# EAGLE design SparkFun_Transceiver_Breakout_NRF24LU1 (EAGLE 7.2.0)
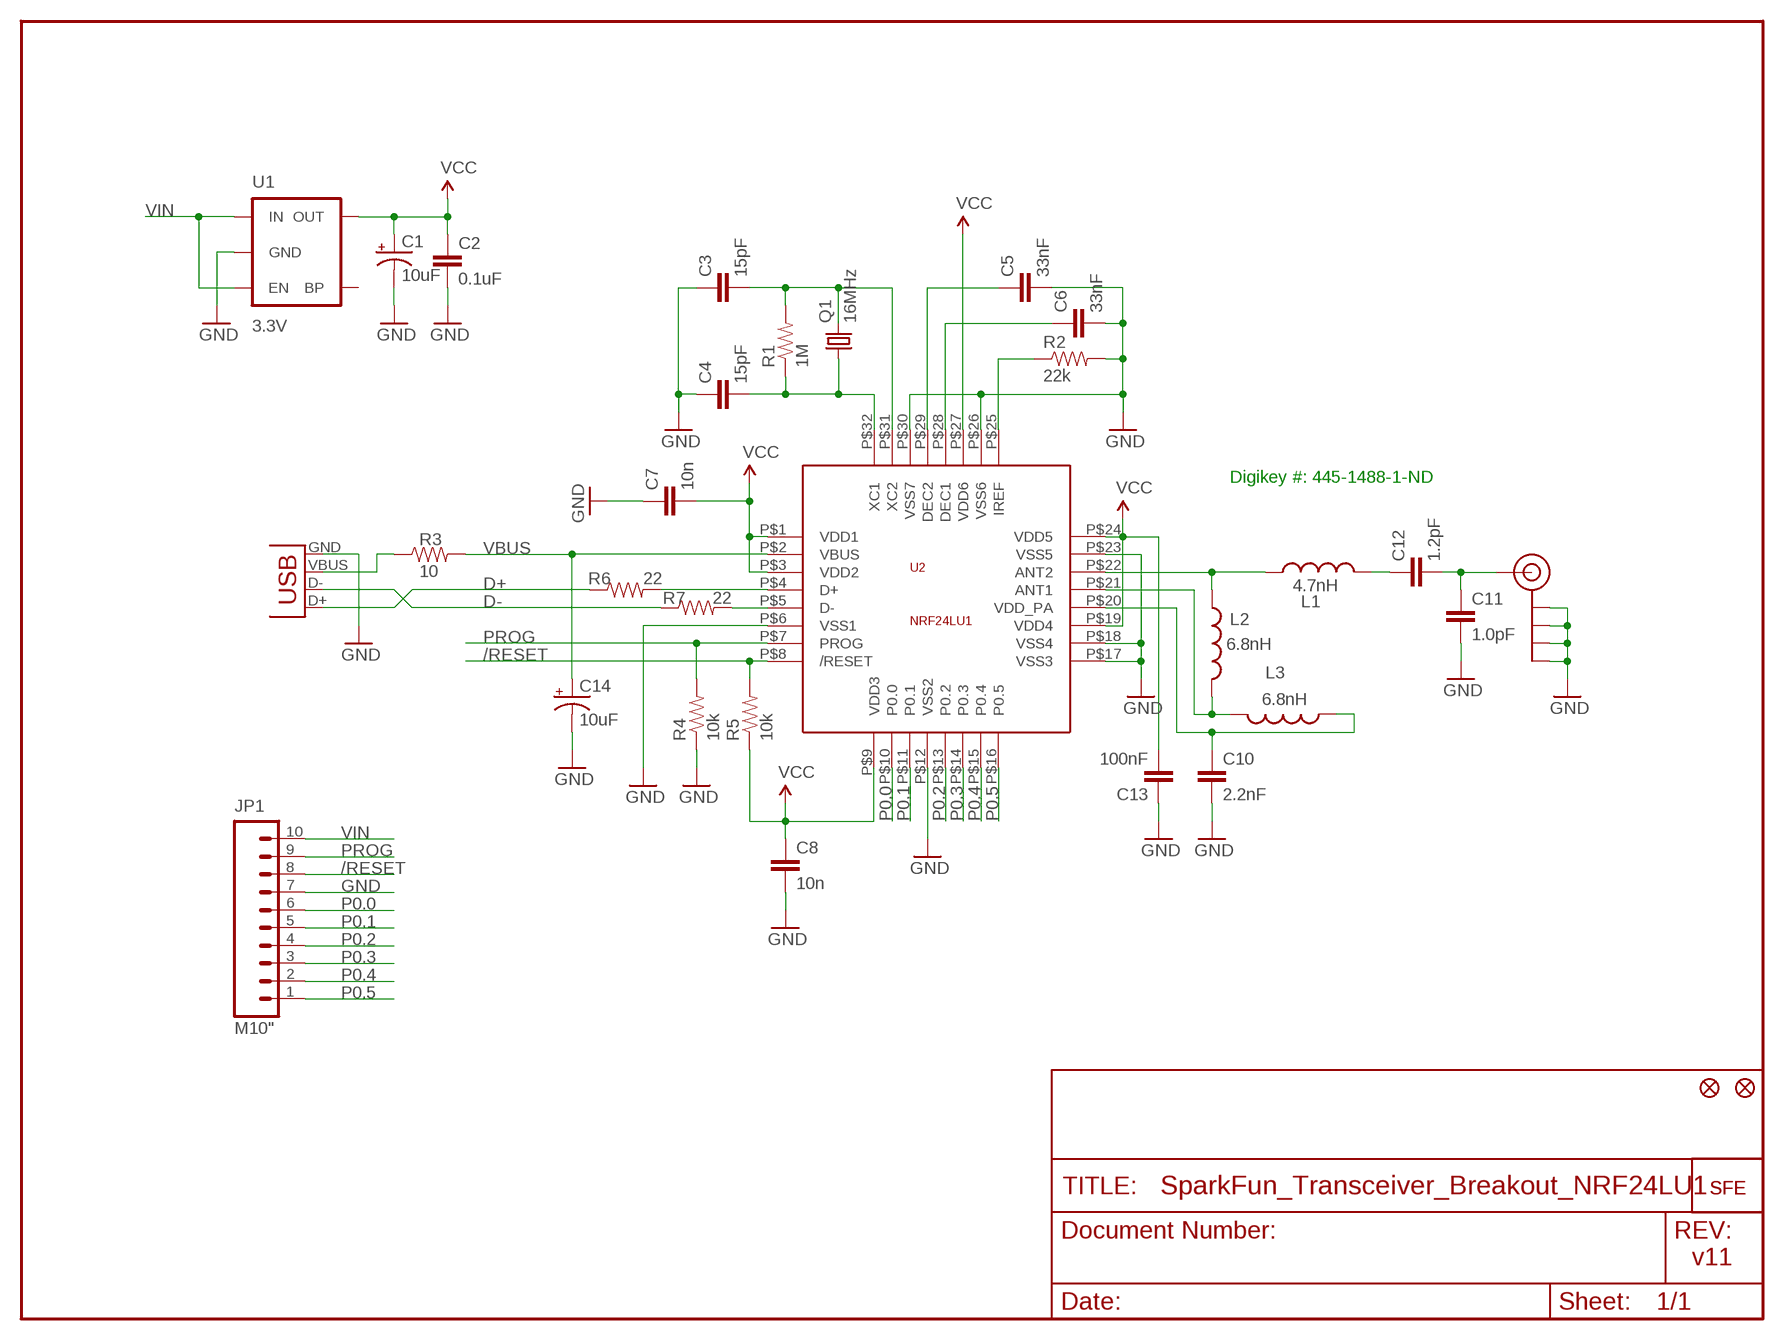
[diagram p0: schematic, sheet 1]

## Parts
C1  10uF  CAP_POL1206  [EIA3216]
C2  0.1uF  CAP0402-CAP  [0402-CAP]
C3  15pF  CAP0402-CAP  [0402-CAP]
C4  15pF  CAP0402-CAP  [0402-CAP]
C5  33nF  CAP0402-CAP  [0402-CAP]
C6  33nF  CAP0402-CAP  [0402-CAP]
C7  10n  CAP0402-CAP  [0402-CAP]
C8  10n  CAP0402-CAP  [0402-CAP]
C10  2.2nF  CAP0402-CAP  [0402-CAP]
C11  1.0pF  CAP0402-CAP  [0402-CAP]
C12  1.2pF  CAP0402-CAP  [0402-CAP]
C13  100nF  CAP0402-CAP  [0402-CAP]
C14  10uF  CAP_POL1206  [EIA3216]
J$1  SMA_EDGE  [SMA-EDGE]
JP1  M10"  [1X10]
JP2  LOGO-SFENEW  [SFE-NEW-WEBLOGO]
L1  4.7nH  INDUCTOR0402  [C0402]
L2  6.8nH  INDUCTOR0402  [C0402]
L3  6.8nH  INDUCTOR0402  [C0402]
Q1  16MHz  CRYSTAL5X3  [CRYSTAL-SMD-5X3]
R1  1M  RESISTOR0402-RES  [0402-RES]
R2  22k  RESISTOR0402-RES  [0402-RES]
R3  10  RESISTOR1206  [1206]
R4  10k  RESISTOR0402-RES  [0402-RES]
R5  10k  RESISTOR0402-RES  [0402-RES]
R6  22  RESISTOR0402-RES  [0402-RES]
R7  22  RESISTOR0402-RES  [0402-RES]
U1  3.3V  V_REG_LDOSMD  [SOT23-5]
U2  NRF24LU1  [QFN-32]
U$12  FIDUCIAL1X2  [FIDUCIAL-1X2]
U$13  FIDUCIAL1X2  [FIDUCIAL-1X2]
U$14  LOGO-SFESK  [SFE-LOGO-FLAME]
X1  USBSMD  [USB-MINIB]

## Nets
/RESET: JP1.8 R5.2 U2.P$8(/RESET)
D+: R6.1 X1.D+
D-: R7.1 X1.D-
GND: C1.C(-) C2.2 C3.1 C4.1 C5.2 C6.2 C7.1 C8.2 C10.2 C11.2 C13.1 C14.C(-) J$1.GND@0(GND) J$1.GND@1(GND) J$1.GND@2(GND) J$1.GND@3(GND) JP1.7 R2.2 R4.1 U1.2(GND) U2.P$6(VSS1) U2.P$12(VSS2) U2.P$17(VSS3) U2.P$18(VSS4) U2.P$23(VSS5) U2.P$26(VSS6) U2.P$30(VSS7) X1.GND
N$1: C3.2 Q1.3 R1.2 U2.P$31(XC2)
N$2: C4.2 Q1.1 R1.1 U2.P$32(XC1)
N$3: L1.1 L2.1 U2.P$22(ANT2)
N$4: C5.1 U2.P$29(DEC2)
N$5: R6.2 U2.P$4(D+)
N$6: R3.1 X1.VBUS
N$7: R7.2 U2.P$5(D-)
N$8: C6.1 U2.P$28(DEC1)
N$9: R2.1 U2.P$25(IREF)
N$20: C12.1 L1.2
N$21: C11.1 C12.2 J$1.SIG(SIGNAL)
N$22: L2.2 L3.2 U2.P$21(ANT1)
N$24: C10.1 L3.1 U2.P$20(VDD_PA)
P0.0: JP1.6 U2.P$10(P0.0)
P0.1: JP1.5 U2.P$11(P0.1)
P0.2: JP1.4 U2.P$13(P0.2)
P0.3: JP1.3 U2.P$14(P0.3)
P0.4: JP1.2 U2.P$15(P0.4)
P0.5: JP1.1 U2.P$16(P0.5)
PROG: JP1.9 R4.2 U2.P$7(PROG)
VBUS: C14.A(+) R3.2 U2.P$2(VBUS)
VCC: C1.A(+) C2.1 C7.2 C8.1 C13.2 R5.1 U1.5(OUT) U2.P$1(VDD1) U2.P$3(VDD2) U2.P$9(VDD3) U2.P$19(VDD4) U2.P$24(VDD5) U2.P$27(VDD6)
VIN: JP1.10 U1.1(IN) U1.3(EN)
Unconnected: U1.4(BP)

## Notes on the sheet
- Digikey #: 445-1488-1-ND
- v11

## Library data of the parts
C1 C14 = SparkFun:CAP_POL: Capacitor Polarized These are standard SMD and PTH capacitors. Normally 10uF, 47uF, and 100uF in electrolytic and tantalum varieties. Always verify the external diameter of the through hole cap, it varies with capacity, voltage, and manufacturer. The EIA devices should be standard.
C2-C8 C10-C13 = SparkFun:CAP: Capacitor Standard 0603 ceramic capacitor, and 0.1" leaded capacitor.
J$1 = SparkFun:SMA_EDGE: SMA Antenna Connector End launch SMA connector. The paste layer has been removed so that the connector can be hand soldered onto the board after reflow.
JP1 = SparkFun:M10: Header 10 Standard 10-pin 0.1" header. Use with straight break away headers (SKU : PRT-00116), right angle break away headers (PRT-00553), swiss pins (PRT-00743), machine pins (PRT-00117), and female headers (PRT-00115).
JP2 U$14 = SparkFun:LOGO-SFE: Spark Fun Electronics PCB Logo This is the standard Spark Fun Electronics PCB logo.
L1-L3 = SparkFun:INDUCTOR: Inductors Basic Inductor/Choke - 0603 and 1206. Footprints are not proven and vary greatly between part numbers.
Q1 = SparkFun:CRYSTAL: Crystals Various standard crystals. Proven footprints. Spark Fun Electronics SKU : COM-00534
R1-R7 = SparkFun:RESISTOR: Resistor Basic schematic elements and footprints for 0603, 1206, and PTH 1/10th watt (small) resistors.
U1 = SparkFun:V_REG_LDO: Voltage Regulator LDO Standard 150mA LDO voltage regulator in SOT-23 layout. Micrel part MIC5205. BP (by-pass) pin is used to lower output noise with 470pF cap.
U2 = SparkFun:NRF24LU1
U$12 U$13 = SparkFun:FIDUCIAL: Fiducial Alignment Points Various fiducial points for machine vision alignment.
X1 = SparkFun:USB: USB Connectors USB-B-PTH is fully proven SKU : PRT-00139 USB-miniB is fully proven SKU : PRT-00587 USB-A-PCB is untested. USB-A-H is throughly reviewed, but untested. Spark Fun Electronics SKU : PRT-00437 USB-B-SMT is throughly reviewed, but untested. Needs silkscreen touching up. USB-A-S has not been used/tested USB-MB-H has not been used/tested

## Board
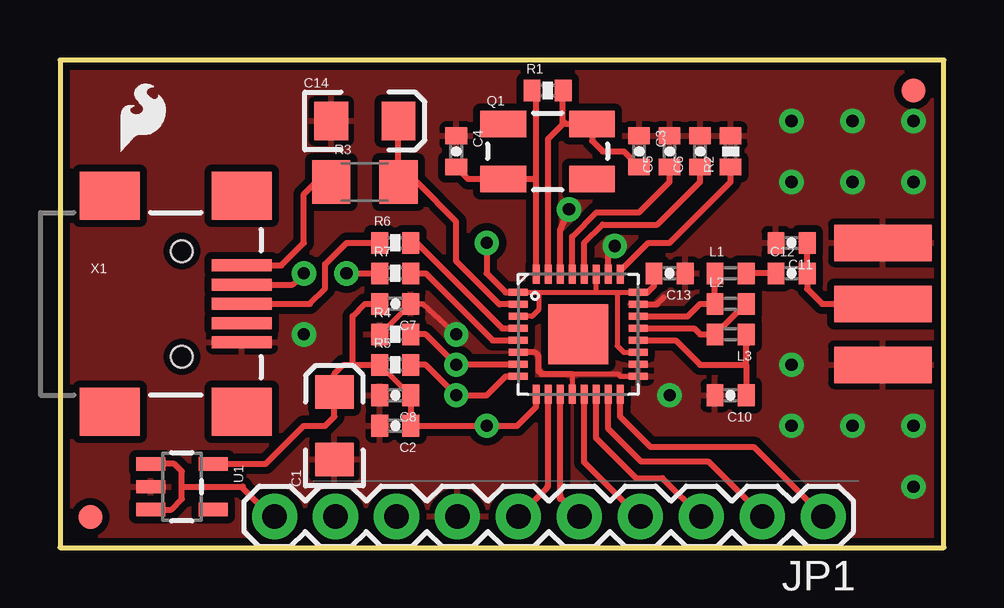
[diagram p1: board, top side]
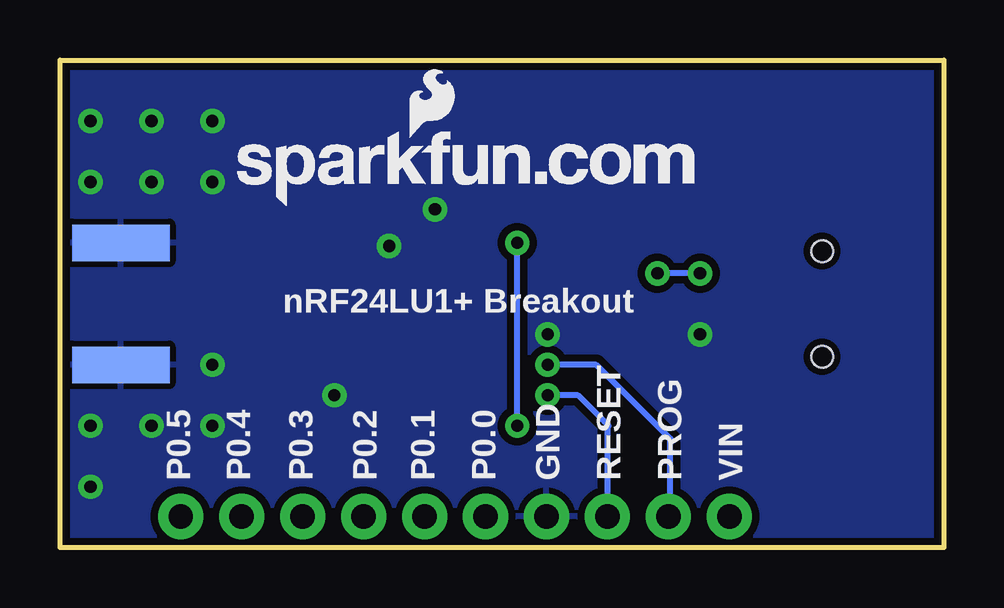
[diagram p2: board, bottom side, seen from below]

Size 36.83 x 20.32 mm. Coordinates in mm from the lower left corner, seen from the top.
Outline: 0,0 36.83,0 36.83,20.32 0,20.32 0,0
Copper layers (1*16): Top 0.035mm / dielectric 1.5mm / Bottom 0.035mm
Design rules "SparkFun": minimum track width 8mil, minimum drill 20mil, track to track 8mil, track to pad 8mil, pad to pad 8mil, via to via 8mil, smd to smd 6mil, copper to edge 8mil, drill to drill 8mil, minimum pad ring 12mil, minimum via ring 10mil, stop-mask expansion 4mil, vias tented up to drill 25mil, thermal gap 10mil

### Footprints (pad centres in the part's own frame; a part is rotated, then mirrored left to right if it is on the bottom)
EIA3216 = smd 1.4 x 1.6: A 1.4,0; C -1.4,0
0402-CAP = smd 0.7 x 0.9: 1 -0.65,0; 2 0.65,0
SMA-EDGE = smd 1.524 x 4.064: GND@0 0,0; GND@1 5.08,0; SIG 2.54,0 | smd 1.524 x 4.064 bottom: GND@2 0,0; GND@3 5.08,0
1X10 = drill 1.016 pad 1.88: 1 0,0; 2 2.54,0; 3 5.08,0; 4 7.62,0; 5 10.16,0; 6 12.7,0; 7 15.24,0; 8 17.78,0; 9 20.32,0; 10 22.86,0
C0402 = smd 0.7 x 0.9: 1 -0.65,0; 2 0.65,0
CRYSTAL-SMD-5X3 = smd 1.9 x 1.1: 1 -1.85,-1.15; 2 1.85,-1.15; 3 1.85,1.15; 4 -1.85,1.15
0402-RES = smd 0.7 x 0.9: 1 -0.65,0; 2 0.65,0
1206 = smd 1.6 x 1.8: 1 -1.4,0; 2 1.4,0
SOT23-5 = smd 0.55 x 1.2: 1 -0.95,-1.3; 2 0,-1.3; 3 0.95,-1.3; 4 0.95,1.3; 5 -0.95,1.3
QFN-32 = smd 0.285 x 0.8: P$1 -1.75,-2.5; P$2 -1.25,-2.5; P$3 -0.75,-2.5; P$4 -0.25,-2.5; P$5 0.25,-2.5; P$6 0.75,-2.5; P$7 1.25,-2.5; P$8 1.75,-2.5; P$17 1.75,2.5; P$18 1.25,2.5; P$19 0.75,2.5; P$20 0.25,2.5; P$21 -0.25,2.5; P$22 -0.75,2.5; P$23 -1.25,2.5; P$24 -1.75,2.5 | smd 0.8 x 0.285: P$9 2.5,-1.75; P$10 2.5,-1.25; P$11 2.5,-0.75; P$12 2.5,-0.25; P$13 2.5,0.25; P$14 2.5,0.75; P$15 2.5,1.25; P$16 2.5,1.75; P$25 -2.5,1.75; P$26 -2.5,1.25; P$27 -2.5,0.75; P$28 -2.5,0.25; P$29 -2.5,-0.25; P$30 -2.5,-0.75; P$31 -2.5,-1.25; P$32 -2.5,-1.75 | smd 2.5 x 2.5: P$33 0,0
FIDUCIAL-1X2 = smd 1 x 1: 1 0,0
USB-MINIB = smd 2.5 x 0.5: D+ 2.5,0; D- 2.5,0.8; GND 2.5,-1.6; ID 2.5,-0.8; VBUS 2.5,1.6 | smd 2.5 x 2: GND@1 -3,-4.5; GND@2 -3,4.5; GND@3 2.5,4.5; GND@4 2.5,-4.5 | hole 0.9: 0,2.2; 0,-2.2

### Placement (x,y rotation side)
C1  11.43,5.08 90 top
C2  13.97,5.08 180 top
C3  24.13,16.51 270 top
C4  16.51,16.51 270 top
C5  25.4,16.51 90 top
C6  26.67,16.51 90 top
C7  13.97,10.16 180 top
C8  13.97,6.35 180 top
C10  27.94,6.35 180 top
C11  30.48,12.7 180 top
C12  30.48,11.43 0 top
C13  25.4,11.43 180 top
C14  12.7,17.78 0 top
J$1  34.29,12.7 270 top
JP1  31.8,1.3 180 top
JP2  29.46,14.22 0 bottom
L1  27.94,11.43 0 top
L2  27.94,10.16 0 top
L3  27.94,8.89 180 top
Q1  20.32,16.51 0 top
R1  20.32,19.05 0 top
R2  27.94,16.51 90 top
R3  12.7,15.24 0 top
R4  13.97,8.89 0 top
R5  13.97,7.62 0 top
R6  13.97,12.7 0 top
R7  13.97,11.43 0 top
U1  5.08,2.54 270 top
U2  21.59,8.89 270 top
U$12  1.27,1.27 0 top
U$13  35.56,19.05 0 top
U$14  2.54,16.51 0 top
X1  5.08,10.16 0 top

### Tracks (layer width: path | path; a pad name or v marks a point on that pad's centre or on a via)
/RESET  (via drill 0.51)
  Top 0.254: 14.61,7.62 R5.2 15.24,7.62 v16.51,6.35 17.78,6.35 18.57,7.14 U2.P$8
  Bottom 0.254: v16.51,6.35 15.24,6.35 13.99,5.11 | 13.99,5.11 13.97,5.08 | 13.99,5.11 14,5.1 14,1.32 JP1.8
D+
  Top 0.254: X1.D+ 10.41,10.16 11.05,10.79 11.05,11.81 11.94,12.7 R6.1
D-  (via drill 0.51)
  Top 0.254: v11.94,11.43 R7.1 | X1.D- 9.69,10.96 v10.16,11.43
  Bottom 0.254: v10.16,11.43 v11.94,11.43
GND  (via drill 0.51)
  Top 0.203: U2.P$12 21.34,6.78 21.34,7.24 23.24,7.24 23.34,7.14 23.7,7.14 U2.P$17 | v16.51,8.89 15.11,10.16 C7.1 13.35,8.89 R4.1
  Top 0.254: C7.1 14.48,10.16 | 21.34,7.24 20.07,7.24 19.94,7.37 19.94,8 19.8,8.14 U2.P$6 | U2.P$30 20.84,13.22 v21.21,14.1 | U2.P$26 22.84,12.3 22.86,12.32 23.37,12.32 v23.11,12.57 | U2.P$23 24.87,10.14 25.15,10.41
  other vias: 35.56,5.08 33.02,5.08 30.48,5.08 30.48,7.62 30.48,15.24 33.02,15.24 35.56,15.24 35.56,17.78 33.02,17.78 30.48,17.78 10.16,8.89 25.4,6.35 35.56,2.54
  pour Bottom (isolate 0.305): 0,0 36.83,0 36.83,20.32 0,20.32
  pour Top (isolate 0.305): 0,0 36.83,0 36.83,20.32 0,20.32
N$1
  Top 0.254: 20.95,19.16 R1.2 20.95,19.04 20.95,17.78 | U2.P$31 20.34,17.04 20.95,17.65 20.95,17.78 | 20.95,17.78 21.07,17.66 Q1.3 22.17,16.95 22.61,16.51 23.5,16.51 24.13,15.88 C3.2
N$2
  Top 0.254: U2.P$32 19.84,15.37 | 19.84,15.37 19.84,18.88 R1.1 | 19.84,15.37 19.83,15.36 Q1.1 17.01,15.36 C4.2
N$3
  Top 0.254: L2.1 27.3,10.16 | L1.1 27.3,11.43 27.29,11.41 L2.1 | U2.P$22 26.15,9.64 26.67,10.16 L2.1
N$4
  Top 0.254: C5.1 25.4,15.24 24.13,13.97 22.35,13.97 21.34,12.96 U2.P$29
N$5
  Top 0.254: R6.2 14.86,12.7 18.42,9.14 U2.P$4
N$6
  Top 0.254: X1.VBUS 9.22,11.76 10.16,12.7 10.16,14.73 10.67,15.24 R3.1
N$7
  Top 0.254: 14.61,11.56 14.62,11.54 R7.2 | R7.2 14.73,11.43 | U2.P$5 18.03,8.64 15.24,11.43 R7.2
N$8
  Top 0.254: C6.1 26.67,15.24 24.89,13.46 22.61,13.46 21.84,12.7 U2.P$28
N$9
  Top 0.254: R2.1 27.94,15.24 25.4,12.7 24.51,12.7 23.34,11.53 U2.P$25
N$20
  Top 0.254: C12.1 29.83,11.32 29.72,11.43 L1.2
N$21
  Top 0.254: C12.2 31.13,11.41 31.24,11.3 31.13,11.19 C12.2 | C12.2 C11.1 | C12.2 31.13,10.78 31.75,10.16 J$1.SIG
N$22
  Top 0.254: L3.2 27.43,8.89 | L2.2 28.57,10.16 27.3,8.89 L3.2 | U2.P$21 26.42,9.14 26.67,8.89 L3.2
N$24
  Top 0.254: L3.1 28.59,8.4 | L3.1 28.59,8.78 28.45,8.64 28.57,8.51 | 28.59,7.62 C10.1 | 28.59,7.62 28.59,8.49 28.57,8.51 | U2.P$20 25.65,8.64 26.67,7.62 28.59,7.62 | 28.57,8.51 28.59,8.52 L3.1
P0.0
  Top 0.254: U2.P$10 20.34,2.56 20.3,2.52 20.3,2.5 JP1.6
P0.1
  Top 0.254: 20.84,2.2 20.84,2.02 | 20.84,2.2 U2.P$11 | 20.84,2.2 20.8,2.2 20.8,2.14 JP1.5
P0.2
  Top 0.254: U2.P$13 21.84,3.56 24.1,1.3 JP1.4 24.2,1.3
P0.3
  Top 0.254: 26.8,1.3 JP1.3 26.7,1.3 25.1,2.9 24,2.9 22.34,4.56 U2.P$14
P0.4
  Top 0.254: U2.P$15 22.84,4.96 24.2,3.6 27,3.6 29.3,1.3 JP1.2
P0.5
  Top 0.254: U2.P$16 23.34,5.46 24.6,4.2 28.9,4.2 JP1.1
PROG  (via drill 0.51)
  Top 0.254: 14.61,8.89 R4.2 15.24,8.89 v16.51,7.62 16.53,7.64 U2.P$7
  Bottom 0.254: v16.51,7.62 14.48,7.62 11.4,4.54 11.4,1.38 JP1.9
VBUS
  Top 0.254: U2.P$2 18.31,10.14 16.51,11.94 16.51,13.59 14.86,15.24 R3.2 C14.A
VCC  (via drill 0.51)
  Top 0.203: C8.1 14.59,6.35 R5.1 | U2.P$19 23.48,8.14 23.22,8.41 23.22,10.62 23.24,10.64 | U2.P$3 19.67,9.64 19.94,9.91 19.94,10.64 | U2.P$1 19.94,10.64 | 19.94,10.64 22.35,10.64 | 22.35,10.64 23.24,10.64 | 23.24,10.64 U2.P$24 | U2.P$27 22.34,10.65 22.35,10.64
  Top 0.254: U2.P$9 19.84,5.87 19.05,5.08 v17.78,5.08 C2.1 C8.1 | 12.19,7.62 R5.1 | C7.2 12.7,10.16 12.19,9.65 12.19,7.62 | U2.P$1 18.57,10.64 17.78,11.43 v17.78,12.7 | 12.19,7.62 11.81,7.62 11.43,7.24 C1.A 11.43,5.46 11.05,5.08 10.16,5.08 8.57,3.49 U1.5 | U2.P$24 24.48,10.64 24.75,10.91 C13.2
  Bottom 0.254: v17.78,5.08 v17.78,12.7
VIN
  Top 0.254: 5.08,2.54 7.62,2.54 7.62,2.52 7.6,2.5 8.8,1.3 JP1.10 | U1.1 4.76,3.49 5.08,3.17 5.08,2.54 | U1.3 4.64,1.59 5.08,2.03 5.08,2.54

### Text on the board
bPlace: nRF24LU1+ Breakout | VIN | PROG | RESET | GND | P0.0 | P0.1 | P0.2 | P0.3 | P0.4 | P0.5